# Altium schematic sheet 1_控制.schdoc
size 309 x 223 mm; Symbol: Sheet-Symbol_A4; Device: Sheet-Symbol_A4; Company: 嘉立创EDA; Version: V1.0; Page Size: A4; @Project Name: 辉光管时钟V2.0; @Page Count: 2; @Update Date: 2024-09-17; @Create Date: 2024-09-08; @Schematic Name: 电源+控制部分; @Page No: 1; @Page Name: 控制; @Board Name: 电源+控制部分; @Create Time: 15:46:08; @Update Time: 13:11:09
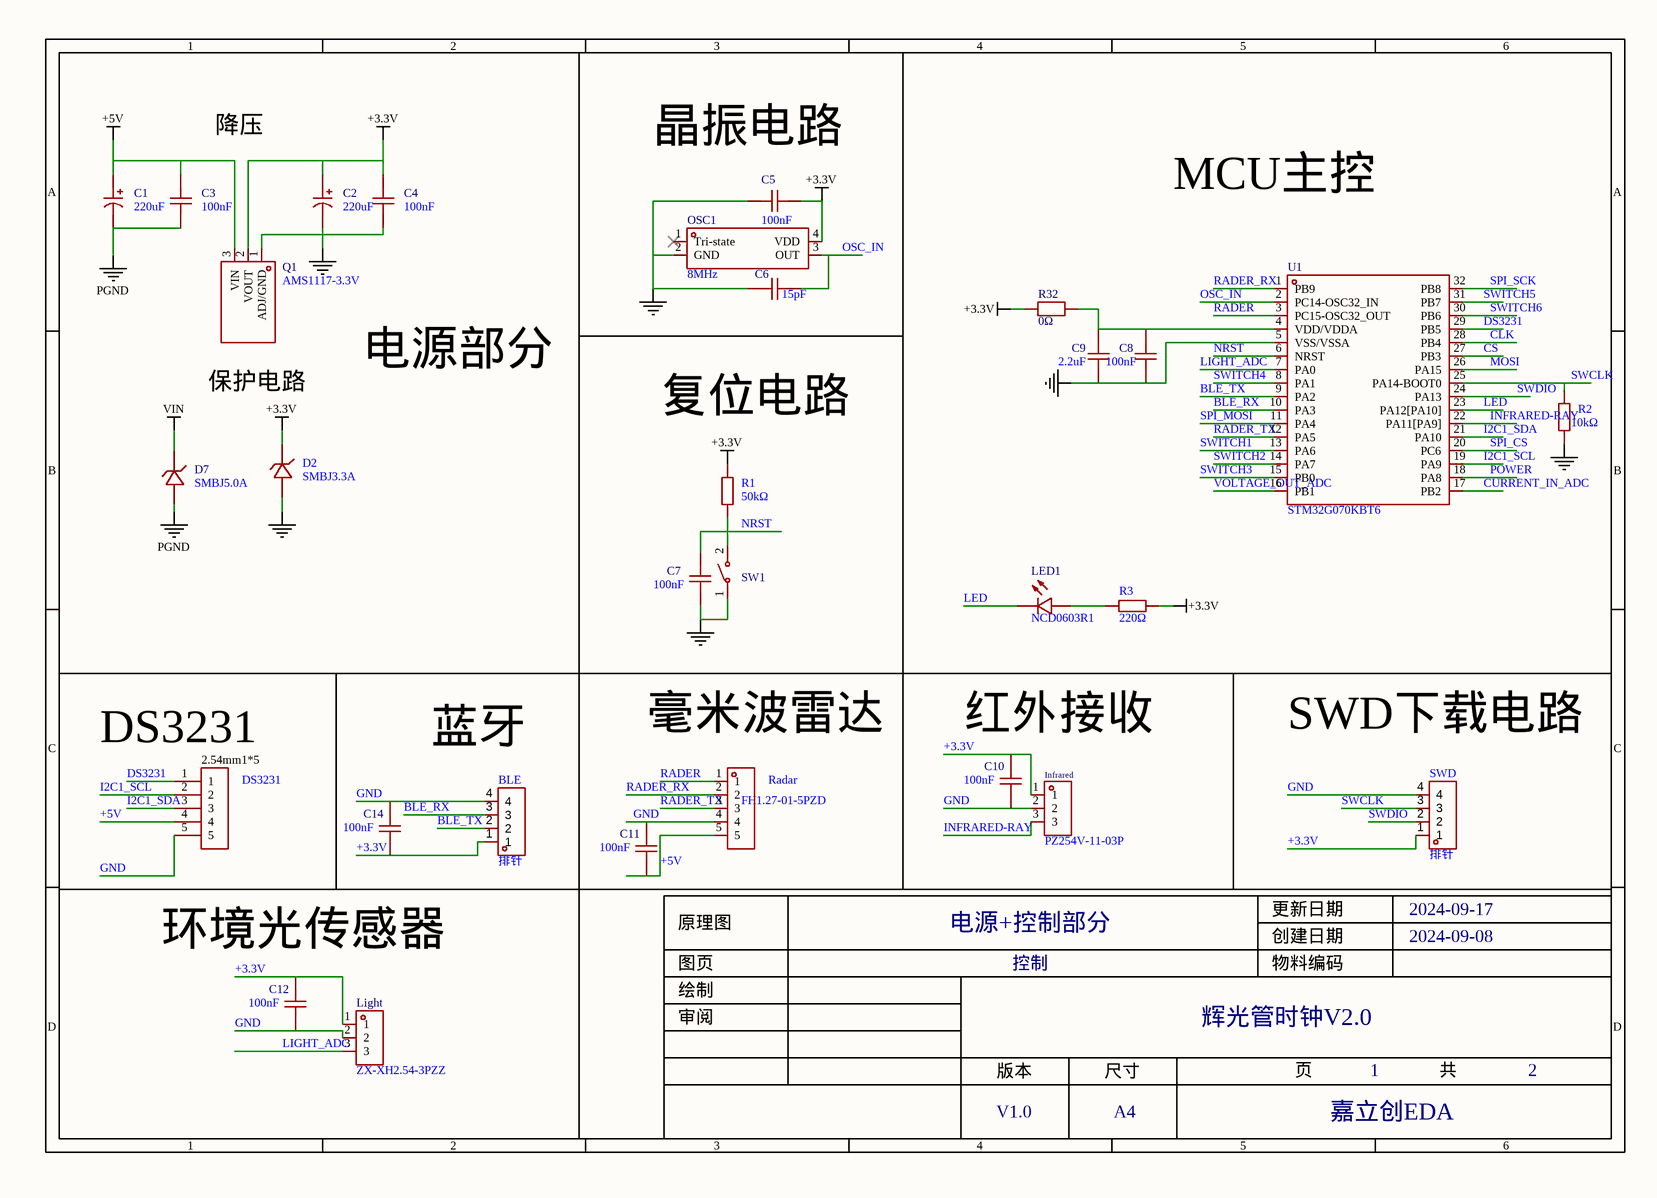
[diagram p0: 1_控制.schdoc]

## Parts
BLE  排针  [SIP-2.54MM-4P-CJT-H8.54]
C1  220uF  [CAP-SMD_BD6.3-L6.6-W6.6-FD]
C2  220uF  [CAP-SMD_BD6.3-L6.6-W6.6-FD]
C3  100nF  [C0603]
C4  100nF  [C0603]
C5  100nF  [C0603]
C6  15pF  [C0603]
C7  100nF  [C0603]
C8  100nF  [C0603]
C9  2.2uF  [C0603]
C10  100nF  [C0603]
C11  100nF  [C0603]
C12  100nF  [C0603]
C14  100nF  [C0603]
D2  SMBJ3.3A  [SMB_L4.6-W3.6-LS5.3-RD]
D7  SMBJ5.0A  [SMB_L4.4-W3.6-LS5.3-RD]
DS3231  (no value)  [2.54mm1*5]
Infrared  PZ254V-11-03P  [HDR-TH_3P-P2.54-V-M]
LED1  NCD0603R1  [LED0603-RD_RED]
Light  ZX-XH2.54-3PZZ  [CONN-TH_3P-P2.54_2501S-3P]
OSC1  8MHz  [OSC-SMD_4P-L3.2-W2.5-BL-1]
Q1  AMS1117-3.3V  [SOT-89-3_L4.5-W2.5-P1.50-LS4.2-BR]
R1  50kΩ  [r0603]
R2  10kΩ  [r0603]
R3  220Ω  [r0603]
R32  0Ω  [R0603]
Radar  FH1.27-01-5PZD  [HDR-TH_5P-P1.27-V-M]
SW1  TS-1088R-02026  [SW-SMD_L3.9-W3.0-P4.45]  (value not drawn)
SWD  排针  [SIP-2.54MM-4P-CJT-H8.54]
U1  STM32G070KBT6  [LQFP-32_L7.0-W7.0-P0.80-LS9.0-BL]

## Blocks framed on the sheet
电源部分: C1-C4 D2 D7 Q1
晶振电路: C5 C6 OSC1
MCU主控: C8 C9 LED1 R2 R3 R32 U1
复位电路: C7 R1 SW1
DS3231: DS3231
蓝牙: BLE C14
毫米波雷达: C11 Radar
SWD下载电路: SWD
红外接收: C10 Infrared
环境光传感器: C12 Light

## Nets
+3.3V: BLE.1 C2.1 C4.2 C5.1 C10.2 C12.2 C14.1 D2.1 Infrared.1 Light.1 OSC1.4(VDD) Q1.2(VOUT) R1.2 R3.1 R32.2 SWD.1
+5V: C1.1 C3.2 C11.1 DS3231.4 Q1.3(VIN) Radar.5
GND: BLE.4 C2.2 C4.1 C5.2 C6.2 C7.1 C8.1 C9.1 C10.1 C11.2 C12.1 C14.2 D2.2 DS3231.5 Infrared.2 Light.2 OSC1.2(GND) Q1.1(ADJ/GND) R2.1 Radar.4 SW1.1 SWD.4 U1.5(VSS/VSSA)
PGND: C1.2 C3.1 D7.2(A)
VIN: D7.1(C)
BLE_RX: BLE.3 U1.10(PA3)
BLE_TX: BLE.2 U1.9(PA2)
CLK: U1.28(PB4)
CS: U1.27(PB3)
CURRENT_IN_ADC: U1.17(PB2)
DS3231: DS3231.1 U1.29(PB5)
I2C1_SCL: DS3231.2 U1.19(PA9)
I2C1_SDA: DS3231.3 U1.21(PA10)
INFRARED-RAY: Infrared.3 U1.22(PA11[PA9])
LED: LED1.1(K) U1.23(PA12[PA10])
LIGHT_ADC: Light.3 U1.7(PA0)
MOSI: U1.26(PA15)
NRST: C7.2 R1.1 SW1.2 U1.6(NRST)
OSC_IN: C6.1 OSC1.3(OUT) U1.2(PC14-OSC32_IN)
POWER: U1.18(PA8)
RADER: Radar.1 U1.3(PC15-OSC32_OUT)
RADER_RX: Radar.2 U1.1(PB9)
RADER_TX: Radar.3 U1.12(PA5)
SPI_CS: U1.20(PC6)
SPI_MOSI: U1.11(PA4)
SPI_SCK: U1.32(PB8)
SWCLK: R2.2 SWD.3 U1.25(PA14-BOOT0)
SWDIO: SWD.2 U1.24(PA13)
SWITCH1: U1.13(PA6)
SWITCH2: U1.14(PA7)
SWITCH3: U1.15(PB0)
SWITCH4: U1.8(PA1)
SWITCH5: U1.31(PB7)
SWITCH6: U1.30(PB6)
VOLTAGE_OUT_ADC: U1.16(PB1)
NetC8_2: C8.2 C9.2 R32.1 U1.4(VDD/VDDA)
NetLED1_2: LED1.2(A) R3.2

Not connected (* = marked no-connect by the designer): OSC1 1(Tri-state)*

## Notes on the sheet
- 降压
- 保护电路
- 1
- 2
- 3
- 4
- 5
- 6
- A
- B
- C
- 原理图
- 电源+控制部分
- 创建日期
- 更新日期
- 2024-09-17
- 2024-09-08
- 审阅
- 绘制
- 图页
- 控制
- 物料编码
- 辉光管时钟V2.0
- D
- 版本
- 尺寸
- 页
- 共
- V1.0
- A4
- 嘉立创EDA

## Library data of the parts
BLE SWD = 排针: Add into BOM: yes; Symbol: 排针; Device: 排针; Convert to PCB: yes
C1 C2 = RVT220UF10V67RV0037: Manufacturer: KNSCHA(科尼盛); Add into BOM: yes; Tolerance: ±20%; Rated Voltage: 10V; Ripple Current: 69mA@120Hz; φD: 6.3mm; L: 5.4mm; Lifetime @ Temp: 2000hrs@105℃; Symbol: RVT220UF10V67RV0037; Device: RVT220UF10V67RV0037; Supplier: LCSC; Supplier Part: C2833309; Manufacturer Part: RVT220UF10V67RV0037; Value: 220uF; JLCPCB Part Class: Extended Part; LCSC Part Name: 220uF ±20% 10V; Supplier Footprint: SMD,D6.3xL5.4mm; Datasheet: https://atta.szlcsc.com/upload/public/pdf/source/20210521/C2833309_008BCE4BC4FC60DA08096FEE6338ABBD.pdf; Convert to PCB: yes; Equivalent Series Resistance(ESR): -; Operating Temperature: -55℃~+105℃
C3-C12 C14 = CC0603KRX7R9BB104: Manufacturer: YAGEO(国巨); Add into BOM: yes; Tolerance: ±10%; Voltage Rated: 50V; Temperature Coefficient: X7R; Symbol: CC0603KRX7R9BB104; Device: CC0603KRX7R9BB104; Supplier: LCSC; Manufacturer Part: CC0603KRX7R9BB104; JLCPCB Part Class: Basic Part; LCSC Part Name: 100nF ±10% 50V; Supplier Footprint: 0603; Datasheet: https://atta.szlcsc.com/upload/public/pdf/source/20180910/C282072_33301C7F631E79921B82A8DAC6BCC5B3.pdf; Convert to PCB: yes
  C3-C5 C8: Value: 100nF; Supplier Part: C14663
  C6: Value: 15pF
  C7 C10-C12 C14: Value: 100nF
  C9: Value: 2.2uF
D2 = SMBJ3.3A_C362089: Manufacturer: JKSEMI(金开盛); Add into BOM: yes; Unidirectional Channels: 1; Bidirectional Channels: 0; Reverse Stand-Off Voltage (Vrwm): 3.3V; Breakdown Voltage: 4.1V; Maximum Clamping Voltage: 7.3V; Peak Pulse Power Dissipation (Ppp)@10/1000us: 600W; Symbol: SMBJ3.3A_C362089; Device: SMBJ3.3A_C362089; LCSC Part Name: 单向TVS 3.3V截止 600W峰值脉冲功率; Supplier Part: C362089; Manufacturer Part: SMBJ3.3A; Supplier Footprint: SMB(DO-214AA); JLCPCB Part Class: Extended Part; Datasheet: https://atta.szlcsc.com/upload/public/pdf/source/20200731/C362089_3B984BF84356FE4A5051ADB3F5B1E766.pdf; Supplier: LCSC; Convert to PCB: yes
D7 = SMBJ5.0A_C726811: Manufacturer: TWGMC(台湾迪嘉); Add into BOM: yes; Symbol: SMBJ5.0A_C726811; Device: SMBJ5.0A_C726811; Supplier: LCSC; Supplier Part: C726811; Manufacturer Part: SMBJ5.0A; JLCPCB Part Class: Extended Part; LCSC Part Name: SMBJ5.0A; Supplier Footprint: SMB; Datasheet: https://atta.szlcsc.com/upload/public/pdf/source/20200901/C726811_07201DC3516E92FF13903A0BAE18F725.pdf; Convert to PCB: yes
DS3231 = 2.54mm1*5: Add into BOM: yes; Symbol: 2.54mm1*5; Device: 2.54mm1*5; Convert to PCB: yes
Infrared = PZ254V-11-03P: Manufacturer: XFCN(兴飞); Symbol: PZ254V-11-03P_C2937625; Add into BOM: yes; Pitch: 2.54mm; Pin Structure: 1x3P; Circluar Pins/Square Pins: 方针; Current Rating (Max): 3A; Voltage Rating (Max): 250V; Device: PZ254V-11-03P; Supplier: LCSC; Supplier Part: C2937625; Manufacturer Part: PZ254V-11-03P; JLCPCB Part Class: Extended Part; LCSC Part Name: 2.54mm 1x3P 直插 方针; Supplier Footprint: 直插,P=2.54mm; Datasheet: 2022-07-12/581362A/62b9d00620994b3696be7eb4af85ad72/双排排针和单排排针.pdf; Convert to PCB: yes; Number of Rows: 单排; Number of Pins: 3; Row Spacing: -; Mounting Type: 直插; Length of Mating Pin: 6mm; Insulation Height: 2.5mm; Length of End Connection Pin: 3mm; Operating Temperature Range: -40℃~+105℃; Color: 黑色
LED1 = NCD0603R1_C84263: Manufacturer: 国星光电; Symbol: FC-DA1608HRK-620D; Add into BOM: yes; Emitted Color: 红色; Forward Voltage (VF): 1.6V~2.6V; Forward Current: 20mA; Power Dissipation: 65mW; Lens Color: 无色透明; Dominant Wavelength: 615nm~630nm; Luminous Intensity: 80mcd~220mcd; Viewing Angle: 130°; Device: NCD0603R1_C84263; Supplier: LCSC; Manufacturer Part: NCD0603R1; Supplier Part: C84263; JLCPCB Part Class: 扩展库; LCSC Part Name: 红灯 0603红灯   正贴; Supplier Footprint: 0603; Datasheet: https://atta.szlcsc.com/upload/public/pdf/source/20200820/C84263_DABC6A75E58F576973B407FDBA283D60.pdf; Convert to PCB: yes; Operating Temperature: -30℃~+85℃
Light = ZX-XH2.54-3PZZ: Manufacturer: Megastar(兆星); Add into BOM: yes; Pins Structure: 1x3P; Pitch: 2.54mm; Reference Series: XH; Number of PINs Per Row: 3; Current Rating (Max): 3A; Symbol: ZX-XH2.54-3PZZ; Device: ZX-XH2.54-3PZZ; LCSC Part Name: ZX-XH2.54-3PZZ; Supplier Part: C7429633; Manufacturer Part: ZX-XH2.54-3PZZ; Supplier Footprint: 插件,P=2.54mm; JLCPCB Part Class: 扩展库; Datasheet: https://atta.szlcsc.com/upload/public/pdf/source/20230619/AE17037A2CFDBE8D9CBA775D61AD0A84.pdf; Supplier: LCSC; Convert to PCB: yes; Mounting Style: 直插; Number of Pins: 3P; Number of Rows: 1; Row Spacing: -; Contact Material: 黄铜; Contact Plating: 锡; Operating Temperature Range: -25℃~+85℃
OSC1 = OT2EL4C4JI-111OLP-8M: Manufacturer: YXC(扬兴晶振); Add into BOM: yes; Supply Voltage: 1.8V~3.3V; Symbol: OT2EL4C4JI-111OLP-8M; Device: OT2EL4C4JI-111OLP-8M; Supplier: LCSC; Supplier Part: C5189450; Manufacturer Part: OT2EL4C4JI-111OLP-8M; Value: 8MHz; JLCPCB Part Class: 扩展库; LCSC Part Name: 8MHZ?1.8V-3.3V?±10PPM YSO110TR; Supplier Footprint: SMD3225-4P; Datasheet: https://atta.szlcsc.com/upload/public/pdf/source/20221009/1148DEA51132416CC556CBB25766F9C8.pdf; Convert to PCB: yes; Operating Temperature: -40℃~+85℃
Q1 = AMS1117-3.3V_C5120796: Manufacturer: MSKSEMI(美森科); Add into BOM: yes; Output Type: 固定; Maximum Input Voltage: 18V; Output Voltage: 3.3V; MAX Output Current: 1A; Dropout Voltage: 1.4V@(1A); standby current: 12mA; Output Polarity: 正极; Number of Outputs: 1; Symbol: AMS1117-3.3V_C5120796; Device: AMS1117-3.3V_C5120796; Supplier: LCSC; Supplier Part: C5120796; Manufacturer Part: AMS1117-3.3V; JLCPCB Part Class: Extended Part; LCSC Part Name: 输入18V 输出3.3V 1A; Supplier Footprint: SOT-89; Datasheet: https://atta.szlcsc.com/upload/public/pdf/source/20231123/6117526697EB8BF6175FDEEBA0877266.pdf; Convert to PCB: yes; Operating Temperature: 0℃~+125℃
R1-R3 = 0805W8F1002T5E_C17414: Manufacturer: UNI-ROYAL(厚声); Symbol: 电阻; Add into BOM: yes; Tolerance: ±1%; Power(Watts): 125mW; Temperature Coefficient: ±100ppm/℃; Overload Voltage (Max): 150V; Device: 0805W8F1002T5E_C17414; LCSC Part Name: 10kΩ ±1% 125mW; Manufacturer Part: 0805W8F1002T5E; Supplier Footprint: 0805; JLCPCB Part Class: Basic Part; Datasheet: https://atta.szlcsc.com/upload/public/pdf/source/20200306/C422600_1E6D84923E4A46A82E41ADD87F860B5C.pdf; Supplier: LCSC; Convert to PCB: yes; Type: 厚膜电阻; Operating Temperature Range: -55℃~+155℃
  R1: Value: 50kΩ
  R2: Value: 10kΩ
  R3: Value: 220Ω
R32 = 5mΩ: Convert to PCB: yes; Origin Footprint: R1206; Symbol: 5mΩ; Device: 5mΩ; Add into BOM: yes
Radar = FH1.27-01-5PZD: Manufacturer: XUNPU(讯普); Add into BOM: yes; Pins Structure: 1x5P; Pitch: 1.27mm; Number of PINs Per Row: 5; Current Rating (Max): 1A; Symbol: FH1.27-01-5PZD; Device: FH1.27-01-5PZD; Supplier: LCSC; Supplier Part: C7500807; Manufacturer Part: FH1.27-01-5PZD; LCSC Part Name: 1x5P 间距:1.27mm 直插; Supplier Footprint: 插件,P=1.27mm; Datasheet: https://atta.szlcsc.com/upload/public/pdf/source/20230809/1C0A5A5FA3077CCA4BCC60F929FB990D.pdf; Convert to PCB: yes; Mounting Style: 直插; Number of Pins: 5P; Number of Rows: 1; Contact Material: 磷青铜; Operating Temperature Range: -40℃~+105℃
SW1 = TS-1088R-02026: Manufacturer: XUNPU(讯普); Add into BOM: yes; Circuit: 单刀单掷; Actuator Style: 圆形按钮; Switch Length: 3.9mm; Switch Width: 2.93mm; Switch Height: 2mm; Contact Current: 50mA; Voltage Rating (DC): 12V; Symbol: TS-1088R-02026; Device: TS-1088R-02026; Supplier: LCSC; Supplier Part: C455280; Manufacturer Part: TS-1088R-02026; JLCPCB Part Class: 扩展库; LCSC Part Name: 3.9*2.93*2mm 立贴 轻触开关; Supplier Footprint: SMD,3x4mm; Datasheet: https://atta.szlcsc.com/upload/public/pdf/source/20191118/C455281_EC5379764BC1462550DF64BBBFEA9579.pdf; Convert to PCB: yes; Mounting Style: 立贴; With Lamp: -; Mechanical Life: -
U1 = STM32G070KBT6: Manufacturer: ST(意法半导体); Add into BOM: yes; CPU Core: ARM Cortex-M0; CPU Maximum Speed: 64MHz; Operating Voltage Range: 2V~3.6V; Program Storage Size: 128KB; Program Memory Type: FLASH; RAM Size: 36KB; GPIO Ports Number: 29; ADC (Bit): 12bit; Peripheral/Function: DMA；PWM; Internal Oscillator: 有; Symbol: STM32G070KBT6; Device: STM32G070KBT6; Supplier: LCSC; Supplier Part: C529339; Manufacturer Part: STM32G070KBT6; JLCPCB Part Class: 扩展库; LCSC Part Name: STM32G070KBT6; Supplier Footprint: LQFP-32(7x7); Datasheet: https://atta.szlcsc.com/upload/public/pdf/source/20200511/C529338_48C8B1D333BC51E6E9668757AAD26A84.pdf; Convert to PCB: yes; EEPROM: -; DAC (Bit): -; PWM (Bit): -; Universal Serial Bus: -; Internal Comparator: -; communication protocol: -; Watchdog: -; Real-Time Clock: -; Infrared Data Association: -; Low-Voltage Detect: -; CCP Capture/Compare: -; Secure Digital Input and Output: -; Direct Memory Access: -; Operating Temperature Range: -40℃~+85℃